# EAGLE schematic dual-verter (EAGLE 7.7.0)
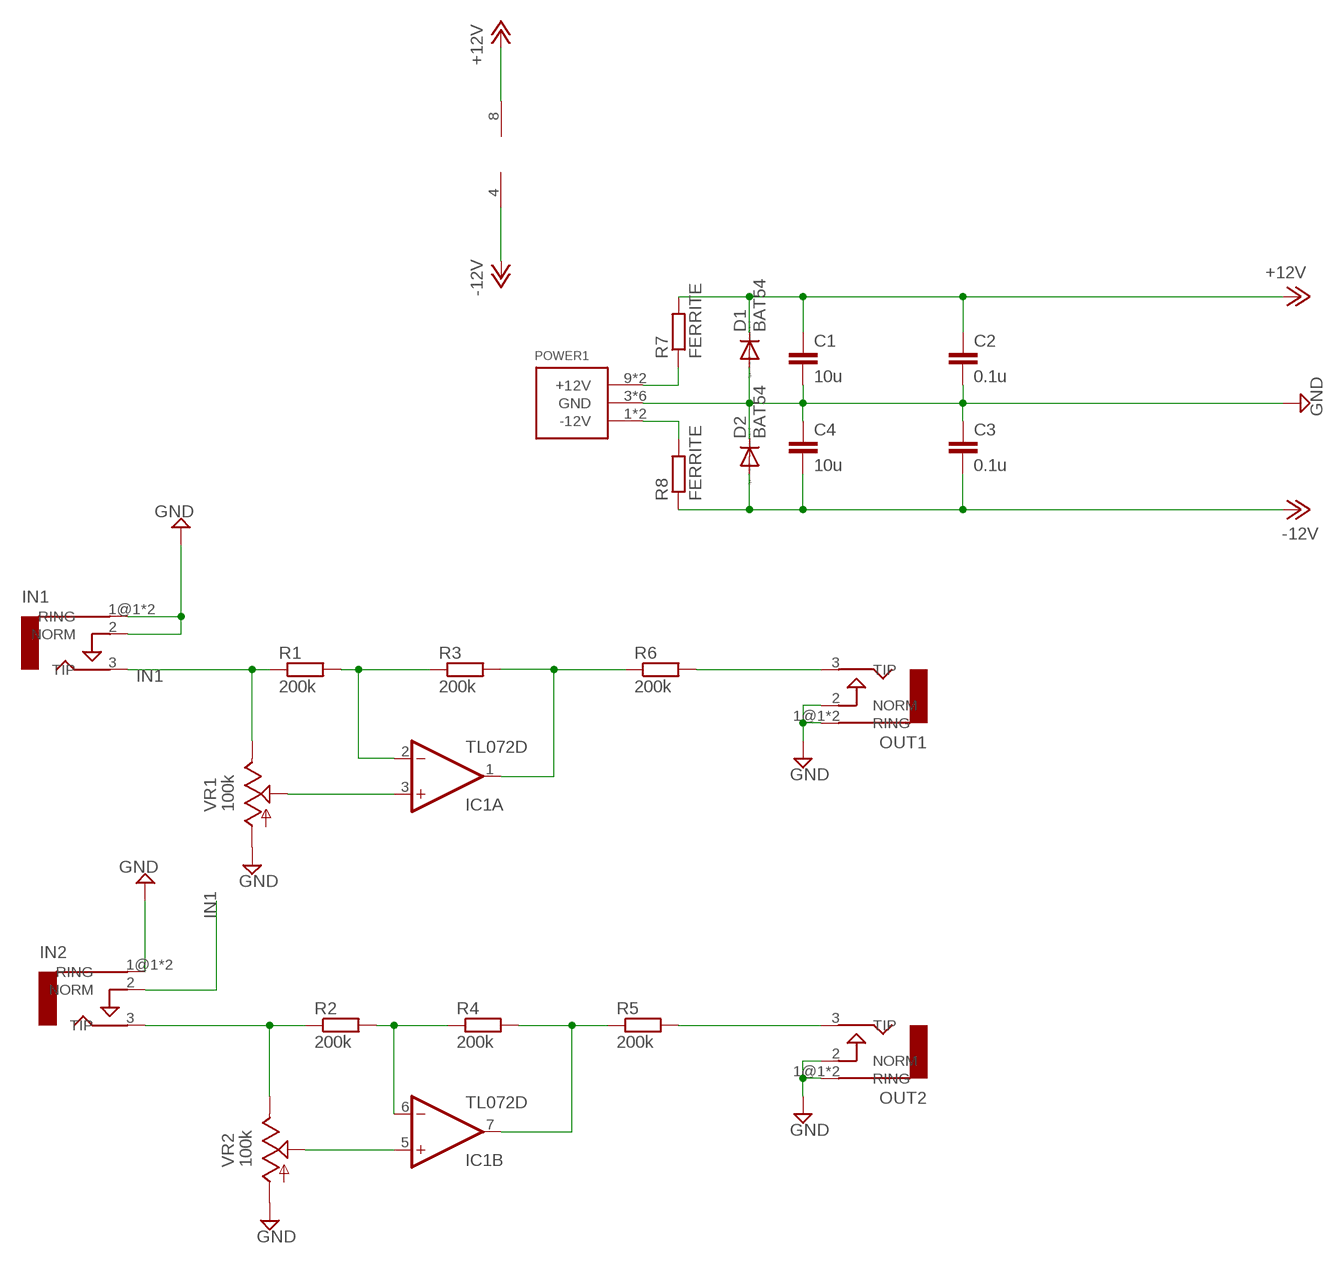
[diagram p0: schematic, sheet 1]

## Parts
C1  10u  C-EUC0805  [C0805]
C2  0.1u  C-EUC0805  [C0805]
C3  0.1u  C-EUC0805  [C0805]
C4  10u  C-EUC0805  [C0805]
D1  BAT54  DIODE-SOD323-W  [SOD323-W]
D2  BAT54  DIODE-SOD323-W  [SOD323-W]
IC1  TL072D  [SO08]
IN1  AUDIO-JACKERTHENVAR  [ERTHENVAR-JACK]
IN2  AUDIO-JACKERTHENVAR  [ERTHENVAR-JACK]
OUT1  AUDIO-JACKERTHENVAR  [ERTHENVAR-JACK]
OUT2  AUDIO-JACKERTHENVAR  [ERTHENVAR-JACK]
POWER1  POWER_SIMPLE10  [POWER_10]
R1  200k  R-EU_R0805  [R0805]
R2  200k  R-EU_R0805  [R0805]
R3  200k  R-EU_R0805  [R0805]
R4  200k  R-EU_R0805  [R0805]
R5  200k  R-EU_R0805  [R0805]
R6  200k  R-EU_R0805  [R0805]
R7  FERRITE  R-EU_R0805  [R0805]
R8  FERRITE  R-EU_R0805  [R0805]
VR1  100k  9MM_SNAP-IN_POT_  [9MM_SNAP-IN_POT]
VR2  100k  9MM_SNAP-IN_POT_  [9MM_SNAP-IN_POT]

## Nets
+12V: C1.1 C2.1 D1.C IC1.8(P:V+) R7.2
-12V: C3.2 C4.2 D2.A IC1.4(P:V-) R8.1
GND: C1.2 C2.2 C3.1 C4.1 D1.A D2.C IN1.1@1(RING) IN1.1@2(RING) IN1.2(NORM) IN2.1@1(RING) IN2.1@2(RING) OUT1.1@1(RING) OUT1.1@2(RING) OUT1.2(NORM) OUT2.1@1(RING) OUT2.1@2(RING) OUT2.2(NORM) POWER1.3(GND) POWER1.4(GND) POWER1.5(GND) POWER1.6(GND) POWER1.7(GND) POWER1.8(GND) VR1.1(A) VR2.1(A)
IN1: IN1.3(TIP) IN2.2(NORM) R1.1 VR1.3(E)
N$1: IC1.3(A:+IN) VR1.2(S)
N$2: IC1.5(B:+IN) VR2.2(S)
N$3: IC1.7(B:OUT) R4.2 R5.1
N$4: IN2.3(TIP) R2.1 VR2.3(E)
N$5: IC1.1(A:OUT) R3.2 R6.1
N$6: IC1.2(A:-IN) R1.2 R3.1
N$7: POWER1.9(+12V) POWER1.10(+12V) R7.1
N$8: IC1.6(B:-IN) R2.2 R4.1
N$9: OUT2.3(TIP) R5.2
N$10: OUT1.3(TIP) R6.2
N$11: POWER1.1(-12V) POWER1.2(-12V) R8.2

## Library data of the parts
C1-C4 = rcl:C-EU: CAPACITOR, European symbol
D1 D2 = diode:DIODE-: DIODE
IC1 = linear:TL072: OP AMP
IN1 IN2 OUT1 OUT2 = erthenvar:AUDIO-JACK: Switching Mono 3.5mm Audio Jack from Erthenvar.
POWER1 = eurorack:POWER_SIMPLE
R1-R8 = rcl:R-EU_: RESISTOR, European symbol
VR1 VR2 = MusicThingModular:9MM_SNAP-IN_POT: 9mm vertical snap-in pot, Alpha / Panasonic style